# Altium schematic sheet 2.5V_Reference.SchDoc
size A
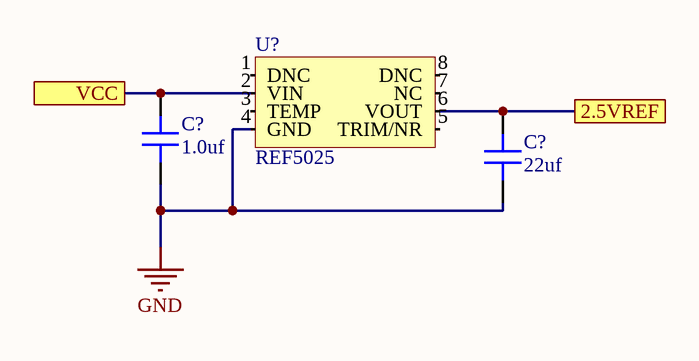
[diagram p0: 2.5V_Reference.SchDoc]

## Parts
(Parts that share a designator on the sheet are numbered #1, #2 ... from top to bottom, then left to right.)
C?#1  value 1.0uf  [CAP 0603/1608]  (hidden comment: Capacitor MLCC 1.0uf 25V CAP 0603/1608)
C?#2  value 22uf  [CAP 0603/1608]  (hidden comment: Capacitor MLCC 22uf 16V CAP 0603/1608)
U?  REF5025  [SOIC-8]

## Ports
2.5VREF, VCC

## Nets
GND: C?#1.1 C?#2.1 U?.4(GND)
2.5VREF: C?#2.2 U?.6(VOUT) ; port 2.5VREF
VCC: C?#1.2 U?.2(VIN) ; port VCC

Not connected (* = marked no-connect by the designer): U? 1(DNC) 3(TEMP) 5(TRIM/NR) 7(NC) 8(DNC)

## Library data of the parts
C?#1 = 589: Manufacturer_id: 1; idCapacitor: 589; Name: Cap_1.0uf_25V_CAP 0603/1608; Dielectric: Ceramic; Created_By: Nick Mah; Drawer_id: 1; Voltage_Rating: 25V; Package: CAP 0603/1608; Created_Date: 10/20/2018
C?#2 = 237: Manufacturer_id: 1; idCapacitor: 237; Name: Cap_22uf_16V_CAP 0603/1608; Dielectric: Ceramic; Created_By: Nick Mah; Drawer_id: 1; Voltage_Rating: 16V; Package: CAP 0603/1608; Created_Date: 10/20/2018
U? = 9: Series Voltage Reference IC ±0.1% 10mA 8-SOIC; Manufacturer_id: 1; MfrPartNo: REF5025AIDR; idPMIC_Lin: 9; Name: REF5025_2.5V_Reg; Value: 2.5V Reference; Vin(Min): 2.7V; Vin(Max): 18V; Vout(Min): 2.5V; Vout_Type: Fixed; Dropout_Voltage: 200mV; Drawer_id: 1; Num_Outputs: 1; Power: Reference; Vout(Max): 2.5V; Current_Rating: 10mA; Package: SOIC-8; Link: https://www.digikey.com/product-detail/en/texas-instruments/REF5025AIDR/296-39165-2-ND/1900163; ComponentLink1Description: Datasheet; ComponentLink1URL: http://www.ti.com/lit/ds/symlink/ref5020.pdf; Supplier1: Digi-Key; Supplier1PartNo: 296-39165-2-ND